# EAGLE design RPi-Display_Bplus_v10 (EAGLE 6.6.0)
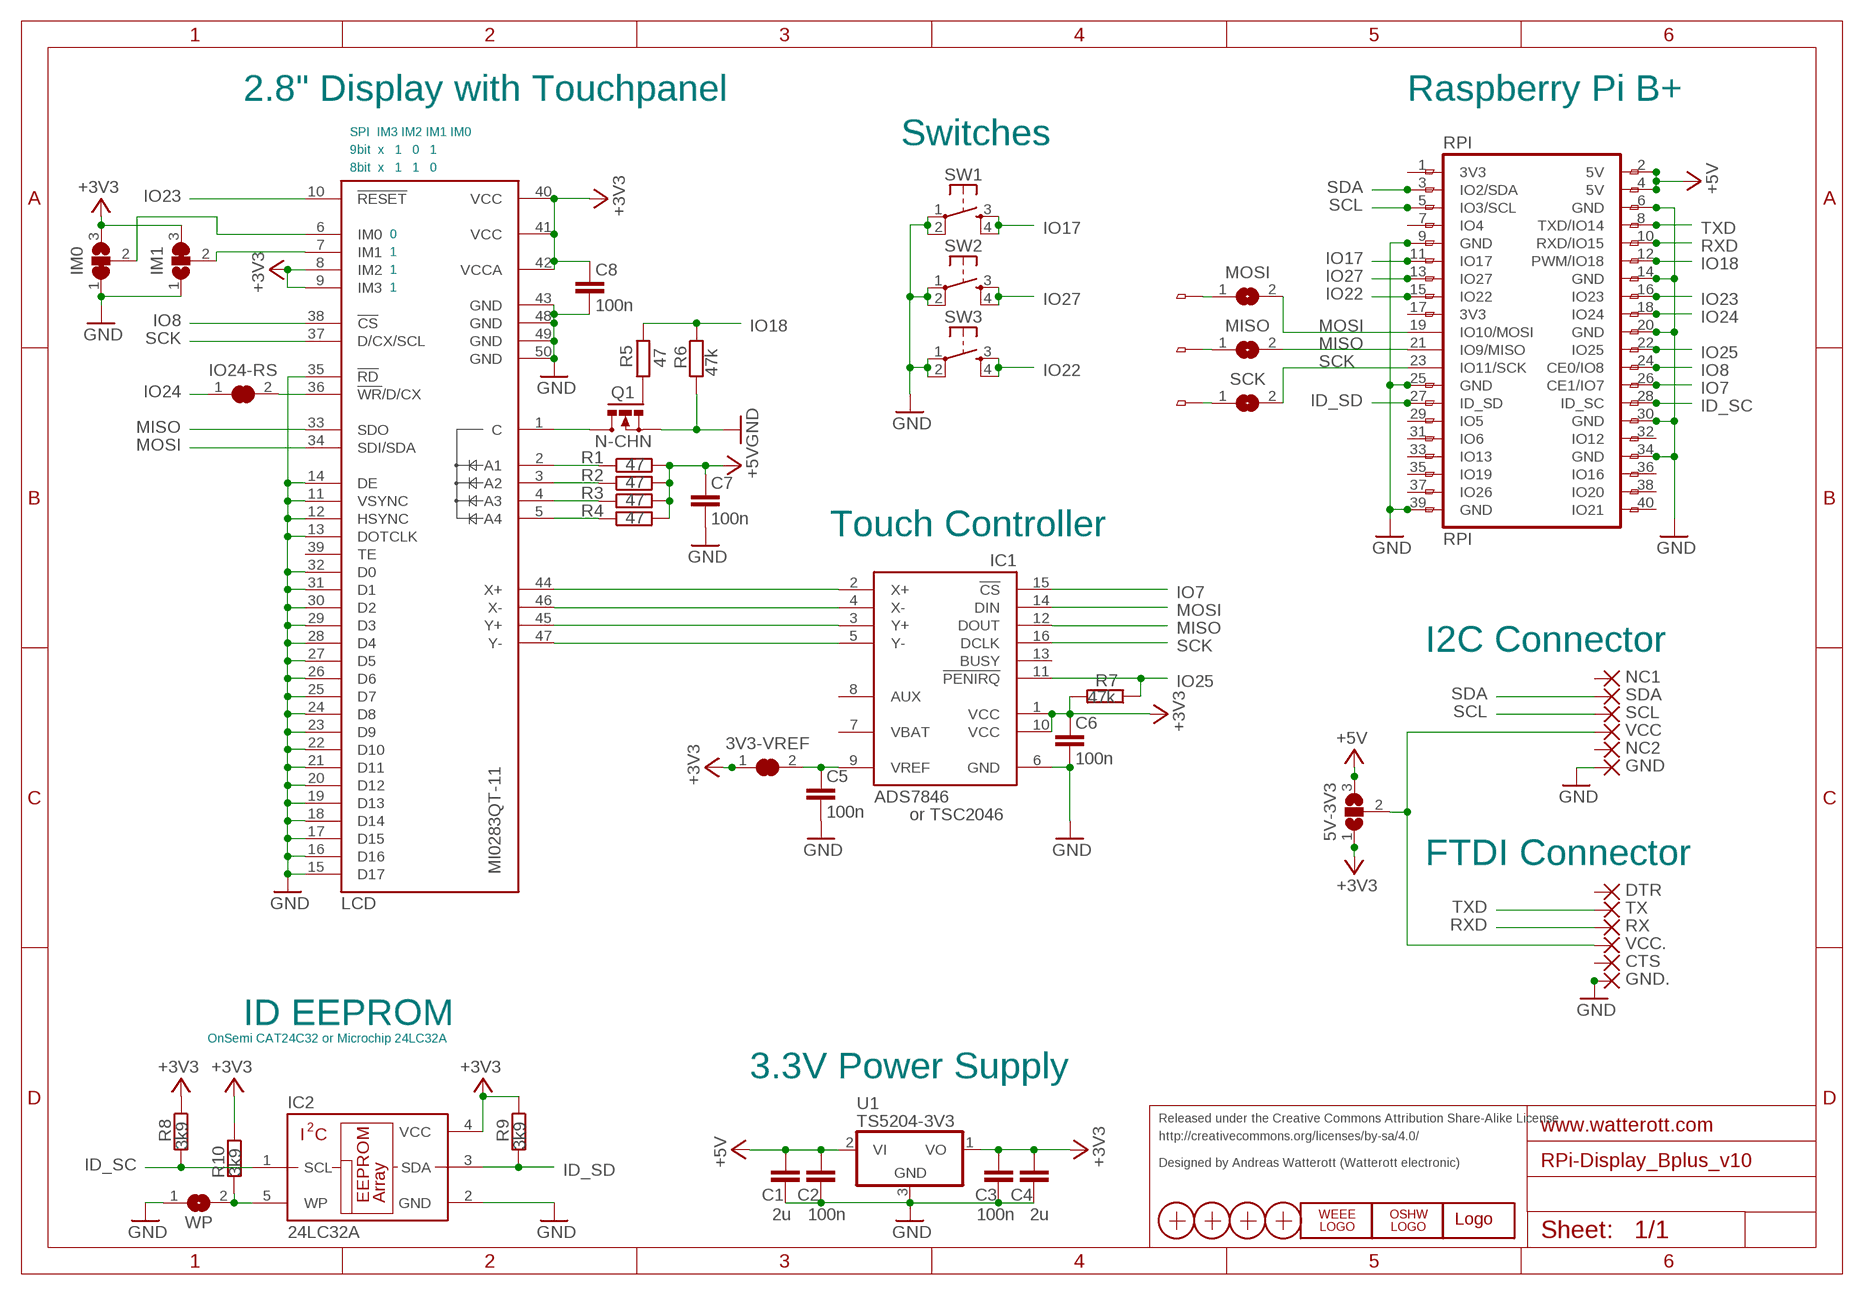
[diagram p0: schematic, sheet 1]

## Parts
3V3-VREF  JUMPER2-NOCREAM  [JUMPER2_NC]
5V-3V3  JUMPER3-NOCREAM  [JUMPER3_NC]
C1  2u  C-EUC0603  [C0603]
C2  100n  C-EUC0603  [C0603]
C3  100n  C-EUC0603  [C0603]
C4  2u  C-EUC0603  [C0603]
C5  100n  C-EUC0603  [C0603]
C6  100n  C-EUC0603  [C0603]
C7  100n  C-EUC0603  [C0603]
C8  100n  C-EUC0603  [C0603]
CTS  PAD-1.27-NC  [PAD-1.27X2.54_NC]
DTR  PAD-1.27-NC  [PAD-1.27X2.54_NC]
GND  PAD-1.27-NC  [PAD-1.27X2.54_NC]
GND.  PAD-1.27-NC  [PAD-1.27X2.54_NC]
GPIO  FH12-40S-0.5SH  [FH12-40S-0.5SH]
IC1  ADS7846  [SSOP16]
IC2  24LC32A  I2C_EEPROM-CAT24AA0X  [SOT23-5]
IM0  JUMPER3-NOCREAM  [JUMPER3_NC]
IM1  JUMPER3-NOCREAM  [JUMPER3_NC]
IO24-RS  JUMPER2-NOCREAM  [JUMPER2_NC]
LCD  MI0283QT-11  [MI0283QT11]
LOGO1  OSHW_LOGO_6MILX0150-NT  [OSHW_6X150_NOTEXT]
LOGO2  WEEE_LOGO  [WEEE]
MISO  JUMPER2-NOCREAM  [JUMPER2_NC]
MOSI  JUMPER2-NOCREAM  [JUMPER2_NC]
NC1  PAD-1.27-NC  [PAD-1.27X2.54_NC]
NC2  PAD-1.27-NC  [PAD-1.27X2.54_NC]
Q1  N-CHN  IRLML2502  [MICRO3]
R1  47  R-EU_R0603  [R0603]
R2  47  R-EU_R0603  [R0603]
R3  47  R-EU_R0603  [R0603]
R4  47  R-EU_R0603  [R0603]
R5  47  R-EU_R0603  [R0603]
R6  47k  R-EU_R0603  [R0603]
R7  47k  R-EU_R0603  [R0603]
R8  3k9  R-EU_R0603  [R0603]
R9  3k9  R-EU_R0603  [R0603]
R10  3k9  R-EU_R0603  [R0603]
RPI  RPI  RPI_B+  [RPI_B+]
RX  PAD-1.27-NC  [PAD-1.27X2.54_NC]
SCK  JUMPER2-NOCREAM  [JUMPER2_NC]
SCL  PAD-1.27-NC  [PAD-1.27X2.54_NC]
SDA  PAD-1.27-NC  [PAD-1.27X2.54_NC]
SW1  SWITCH-PTS840P  [SW_PTS840P]
SW2  SWITCH-PTS840P  [SW_PTS840P]
SW3  SWITCH-PTS840P  [SW_PTS840P]
TX  PAD-1.27-NC  [PAD-1.27X2.54_NC]
U1  TS5204-3V3  TS5204  [SOT23]
U$1  WE-LOGO  WE-LOGOPLACE  [WE-LOGO]
VCC  PAD-1.27-NC  [PAD-1.27X2.54_NC]
VCC.  PAD-1.27-NC  [PAD-1.27X2.54_NC]
WP  JUMPER2-NOCREAM  [JUMPER2_NC]
X1  PASSER  [PASSER]
X2  PASSER  [PASSER]
X3  PASSER  [PASSER]
X4  PASSER  [PASSER]

## Nets
+3V3: 3V3-VREF.1 5V-3V3.1 C3.1 C4.1 C6.1 C8.1 IC1.1(VCC) IC1.10(VCC) IC2.4(VCC) IM0.3 IM1.3 LCD.8(IM2) LCD.9(IM3) LCD.40(VCC) LCD.41(VCC) LCD.42(VCCA) R7.2 R8.1 R9.1 R10.1 U1.1(VO)
+5V: 5V-3V3.3 C1.1 C2.1 C7.1 GPIO.37 GPIO.39 R1.2 R2.2 R3.2 R4.2 RPI.2(5V) RPI.4(5V) U1.2(VI)
C1: LCD.1(C) Q1.3(D)
GND: C1.2 C2.2 C3.2 C4.2 C5.2 C6.2 C7.2 C8.2 GND.1(P) GND..1(P) GPIO.2 GPIO.7 GPIO.11 GPIO.16 GPIO.21 GPIO.27 GPIO.32 GPIO.35 IC1.6(GND) IC2.2(GND) IM0.1 IM1.1 LCD.11(VSYNC) LCD.12(HSYNC) LCD.13(DOTCLK) LCD.14(DE) LCD.15(D17) LCD.16(D16) LCD.17(D15) LCD.18(D14) LCD.19(D13) LCD.20(D12) LCD.21(D11) LCD.22(D10) LCD.23(D9) LCD.24(D8) LCD.25(D7) LCD.26(D6) LCD.27(D5) LCD.28(D4) LCD.29(D3) LCD.30(D2) LCD.31(D1) LCD.32(D0) LCD.35(!RD) LCD.43(GND) LCD.48(GND) LCD.49(GND) LCD.50(GND) Q1.2(S) R6.2 RPI.6(GND) RPI.9(GND) RPI.14(GND) RPI.20(GND) RPI.25(GND) RPI.30(GND) RPI.34(GND) RPI.39(GND) SW1.1(P) SW1.2(P1) SW2.1(P) SW2.2(P1) SW3.1(P) SW3.2(P1) U1.3(GND) WP.1
ID_SC: GPIO.13 IC2.1(SCL) R8.2 RPI.28(ID_SC)
ID_SD: GPIO.14 IC2.3(SDA) R9.2 RPI.27(ID_SD)
IM0: IM0.2 LCD.6(IM0)
IM1: IM1.2 LCD.7(IM1)
IO7: GPIO.15 IC1.15(!CS) RPI.26(CE1/IO7)
IO8: GPIO.17 LCD.38(!CS) RPI.24(CE0/IO8)
IO17: GPIO.30 RPI.11(IO17) SW1.3(S) SW1.4(S1)
IO18: GPIO.29 R5.2 R6.1 RPI.12(PWM/IO18)
IO22: GPIO.26 RPI.15(IO22) SW3.3(S) SW3.4(S1)
IO23: GPIO.25 LCD.10(!RESET) RPI.16(IO23)
IO24: GPIO.23 IO24-RS.1 RPI.18(IO24)
IO25: GPIO.19 IC1.11(!PENIRQ) R7.1 RPI.22(IO25)
IO27: GPIO.28 RPI.13(IO27) SW2.3(S) SW2.4(S1)
LED_A1: LCD.2(A1) R1.1
LED_A2: LCD.3(A2) R2.1
LED_A3: LCD.4(A3) R3.1
LED_A4: LCD.5(A4) R4.1
LEDPWM: Q1.1(G) R5.1
MISO: IC1.12(DOUT) LCD.33(SDO) MISO.2 RPI.21(IO9/MISO)
MOSI: IC1.14(DIN) LCD.34(SDI/SDA) MOSI.2 RPI.19(IO10/MOSI)
N$1: IO24-RS.2 LCD.36(!WR!/D/CX)
N$2: IC2.5(WP) R10.2 WP.2
N$4: GPIO.22 MOSI.1
N$5: 5V-3V3.2 VCC.1(P) VCC..1(P)
N$6: GPIO.20 MISO.1
N$7: GPIO.18 SCK.1
N$8: GPIO.40 RPI.1(3V3)
N$9: GPIO.34 RPI.7(IO4)
N$13: GPIO.24 RPI.17(3V3)
N$15: GPIO.12 RPI.29(IO5)
N$16: GPIO.10 RPI.31(IO6)
N$17: GPIO.8 RPI.33(IO13)
N$18: GPIO.6 RPI.35(IO19)
N$19: GPIO.4 RPI.37(IO26)
N$25: GPIO.9 RPI.32(IO12)
N$27: GPIO.5 RPI.36(IO16)
N$28: GPIO.3 RPI.38(IO20)
N$29: GPIO.1 RPI.40(IO21)
RXD: GPIO.31 RPI.10(RXD/IO15) RX.1(P)
SCK: IC1.16(DCLK) LCD.37(D/CX/SCL) RPI.23(IO11/SCK) SCK.2
SCL: GPIO.36 RPI.5(IO3/SCL) SCL.1(P)
SDA: GPIO.38 RPI.3(IO2/SDA) SDA.1(P)
TXD: GPIO.33 RPI.8(TXD/IO14) TX.1(P)
VREF: 3V3-VREF.2 C5.1 IC1.9(VREF)
X+: IC1.2(X+) LCD.44(X+)
X-: IC1.4(X-) LCD.46(X-)
Y+: IC1.3(Y+) LCD.45(Y+)
Y-: IC1.5(Y-) LCD.47(Y-)
Unconnected: CTS.1(P) DTR.1(P) IC1.7(VBAT) IC1.8(AUX) IC1.13(BUSY) LCD.39(TE) NC1.1(P) NC2.1(P)

## Notes on the sheet
- 2.8" Display with Touchpanel | Raspberry Pi B+
- SPI  IM3 IM2 IM1 IM0
- Switches
- 9bit  x   1   0   1
- 8bit  x   1   1   0
- 0
- 1
- 1
- 1
- Touch Controller
- I2C Connector
- or TSC2046
- FTDI Connector
- ID EEPROM
- OnSemi CAT24C32 or Microchip 24LC32A
- 3.3V Power Supply
- Released under the Creative Commons Attribution Share-Alike License
- http://creativecommons.org/licenses/by-sa/4.0/
- Designed by Andreas Watterott (Watterott electronic)

## Library data of the parts
3V3-VREF IO24-RS MISO MOSI SCK WP = we-rcl:JUMPER2
5V-3V3 IM0 IM1 = we-rcl:JUMPER3
C1-C8 = rcl:C-EU: CAPACITOR, European symbol
CTS DTR GND GND. NC1 NC2 RX SCL SDA TX VCC VCC. = we-rcl:PAD
GPIO = con-hirose:FH12-40S-0.5S: 0.5mm Pitch Connectors For FPC/FFC Source: Data sheet <http://www.hirose.co.jp/cataloge_hp/e58605370.pdf>; MPN: FH12-40S-0.5SH(55); OC_FARNELL: 1324556; OC_NEWARK: 34M6178
IC1 = Display:ADS7846: ADS7846 / TSC2046 Touch Screen Controller
IC2 = we-chip:I2C_EEPROM
LCD = we-opto:MI0283QT: Multi-Inno MIO283QT-9 / -11 Display (240x320) with Ilitek ILI9341 controller
LOGO1 = OSHW:OSHW_LOGO_6MIL
LOGO2 = we-symbol:WEEE_LOGO
Q1 = IRF-sot23:IRLML2502: N-Channel Power MOSFET
R1-R10 = rcl:R-EU_: RESISTOR, European symbol
RPI = we-board:RPI_B+: Raspberry Pi Model B+
SW1-SW3 = we-switch:SWITCH
U1 = Voltage-Reg:TS5204
U$1 = welectronic:WE-LOGO
X1-X4 = SMD:PASSER

## Board
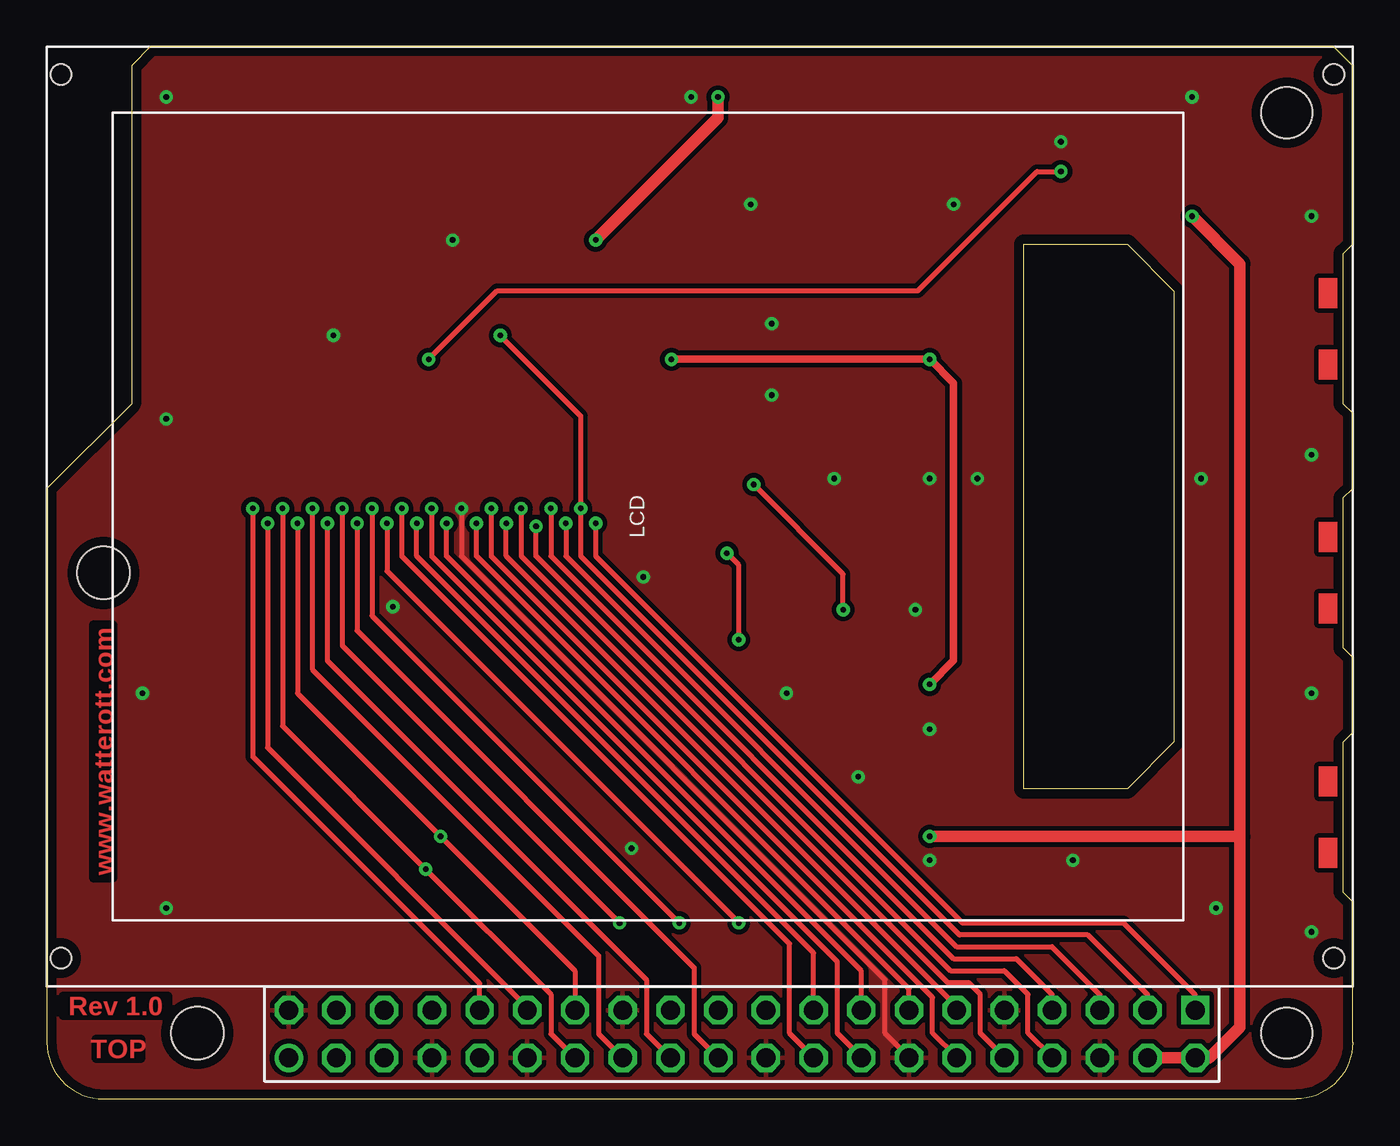
[diagram p1: board, top side]
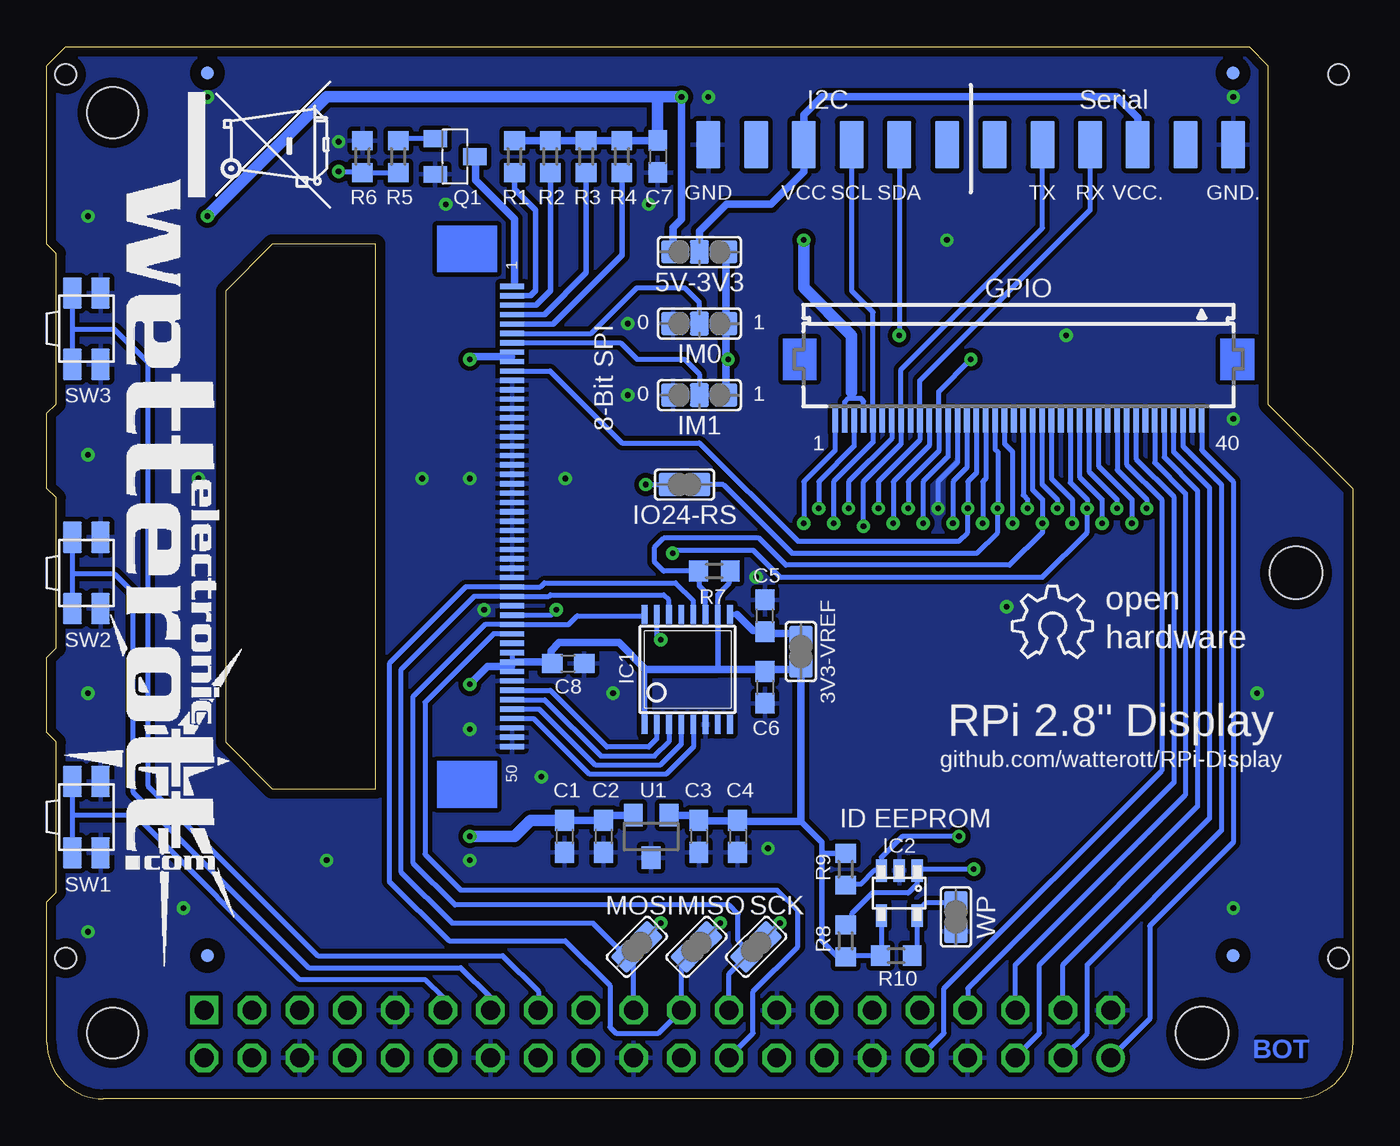
[diagram p2: board, bottom side, seen from below]

Size 69.5 x 56 mm. Coordinates in mm from the lower left corner, seen from the top.
Outline: 3,0 66.5,0 arc90 69.5,3 69.5,10.5 69,11 69,19 69.5,19.5 69.5,23.5 69,24 69,32 69.5,32.5 69.5,36.5 69,37 69,45 69.5,45.5 69.5,55 68.5,56 5.5,56 4.5,55 4.5,37 0,32.5 0,3 arc90 3,0
Copper layers (1*16): Top 0.035mm / dielectric 1.5mm / Bottom 0.035mm
Design rules "default *": minimum track width 6mil, minimum drill 0.3mm, track to track 6mil, track to pad 6mil, pad to pad 6mil, via to via 6mil, smd to smd 6mil, copper to edge 20mil, drill to drill 8mil, minimum pad ring 10mil, minimum via ring 8mil, stop-mask expansion 0.3mm, vias tented up to drill 0.5mm, thermal gap 10mil
Holes 2.8 mm at 3,28 8,3.5
Holes 2.7 mm at 66,3.5 66,52.5

### Footprints (pad centres in the part's own frame; a part is rotated, then mirrored left to right if it is on the bottom)
JUMPER2_NC = smd 1.25 x 1.25: 1 0,0.76; 2 0,-0.76
JUMPER3_NC = smd 1.25 x 1.25: 1 0,1.4; 3 0,-1.4 | smd 1.25 x 1: 2 0,0
C0603 = smd 1.1 x 1: 1 -0.85,0; 2 0.85,0
PAD-1.27X2.54_NC = smd 1.27 x 2.54: 1 0,0
FH12-40S-0.5SH = smd 0.3 x 1.3: 1 -9.75,3.25; 2 -9.25,3.25; 3 -8.75,3.25; 4 -8.25,3.25; 5 -7.75,3.25; 6 -7.25,3.25; 7 -6.75,3.25; 8 -6.25,3.25; 9 -5.75,3.25; 10 -5.25,3.25; 11 -4.75,3.25; 12 -4.25,3.25; 13 -3.75,3.25; 14 -3.25,3.25; 15 -2.75,3.25; 16 -2.25,3.25; 17 -1.75,3.25; 18 -1.25,3.25; 19 -0.75,3.25; 20 -0.25,3.25; 21 0.25,3.25; 22 0.75,3.25; 23 1.25,3.25; 24 1.75,3.25; 25 2.25,3.25; 26 2.75,3.25; 27 3.25,3.25; 28 3.75,3.25; 29 4.25,3.25; 30 4.75,3.25; 31 5.25,3.25; 32 5.75,3.25; 33 6.25,3.25; 34 6.75,3.25; 35 7.25,3.25; 36 7.75,3.25; 37 8.25,3.25; 38 8.75,3.25; 39 9.25,3.25; 40 9.75,3.25
SSOP16 = smd 0.305 x 1.016: 1 -2.925,-2.918; 2 -2.275,-2.918; 3 -1.625,-2.918; 4 -0.975,-2.918; 5 -0.325,-2.918; 6 0.325,-2.918; 7 0.975,-2.918; 8 1.625,-2.918; 9 1.625,2.918; 10 0.975,2.918; 11 0.325,2.918; 12 -0.325,2.918; 13 -0.975,2.918; 14 -1.625,2.918; 15 -2.275,2.918; 16 -2.925,2.918
SOT23-5 = smd 1.2 x 0.6: 1 -1.2,0.95; 2 -1.2,0; 3 -1.2,-0.95; 4 1.2,-0.95; 5 1.2,0.95
MI0283QT11 = smd 0.279 x 1.27 bottom: 1 12.25,24.762; 2 11.75,24.762; 3 11.25,24.762; 4 10.75,24.762; 5 10.25,24.762; 6 9.75,24.762; 7 9.25,24.762; 8 8.75,24.762; 9 8.25,24.762; 10 7.75,24.762; 11 7.25,24.762; 12 6.75,24.762; 13 6.25,24.762; 14 5.75,24.762; 15 5.25,24.762; 16 4.75,24.762; 17 4.25,24.762; 18 3.75,24.762; 19 3.25,24.762; 20 2.75,24.762; 21 2.25,24.762; 22 1.75,24.762; 23 1.25,24.762; 24 0.75,24.762; 25 0.25,24.762; 26 -0.25,24.762; 27 -0.75,24.762; 28 -1.25,24.762; 29 -1.75,24.762; 30 -2.25,24.762; 31 -2.75,24.762; 32 -3.25,24.762; 33 -3.75,24.762; 34 -4.25,24.762; 35 -4.75,24.762; 36 -5.25,24.762; 37 -5.75,24.762; 38 -6.25,24.762; 39 -6.75,24.762; 40 -7.25,24.762; 41 -7.75,24.762; 42 -8.25,24.762; 43 -8.75,24.762; 44 -9.25,24.762; 45 -9.75,24.762; 46 -10.25,24.762; 47 -10.75,24.762; 48 -11.25,24.762; 49 -11.75,24.762; 50 -12.25,24.762 | hole 1.1: 23.54,1; -23.5,1; 23.54,68.75; -23.5,68.75
MICRO3 = smd 0.9 x 1.25: 1 -0.95,-1.05; 2 0.95,-1.05; 3 0,1.05
R0603 = smd 1 x 1.1: 1 -0.85,0; 2 0.85,0
RPI_B+ = drill 1 square: 1 -24.13,-1.27 | drill 1 octagon: 2 -24.13,1.27; 3 -21.59,-1.27; 4 -21.59,1.27; 5 -19.05,-1.27; 6 -19.05,1.27; 7 -16.51,-1.27; 8 -16.51,1.27; 9 -13.97,-1.27; 10 -13.97,1.27; 11 -11.43,-1.27; 12 -11.43,1.27; 13 -8.89,-1.27; 14 -8.89,1.27; 15 -6.35,-1.27; 16 -6.35,1.27; 17 -3.81,-1.27; 18 -3.81,1.27; 19 -1.27,-1.27; 20 -1.27,1.27; 21 1.27,-1.27; 22 1.27,1.27; 23 3.81,-1.27; 24 3.81,1.27; 25 6.35,-1.27; 26 6.35,1.27; 27 8.89,-1.27; 28 8.89,1.27; 29 11.43,-1.27; 30 11.43,1.27; 31 13.97,-1.27; 32 13.97,1.27; 33 16.51,-1.27; 34 16.51,1.27; 35 19.05,-1.27; 36 19.05,1.27; 37 21.59,-1.27; 38 21.59,1.27; 39 24.13,-1.27 | drill 1: 40 24.13,1.27
SW_PTS840P = smd 1.65 x 1: 1 -1.9,0.75; 2 1.9,0.75; 3 -1.9,-0.75; 4 1.9,-0.75
SOT23 = smd 1 x 1.2: 1 -0.95,-1.132; 2 0.95,-1.132; 3 0,1.132
PASSER = smd 0.7 x 0.7: X 0,0

### Placement (x,y rotation side)
3V3-VREF  29.37,23.81 180 bottom
5V-3V3  34.77,45.09 270 bottom
C1  41.94,13.97 270 bottom
C2  39.88,13.97 270 bottom
C3  34.8,13.97 270 bottom
C4  32.73,13.97 270 bottom
C5  31.27,25.72 90 bottom
C6  31.27,21.91 270 bottom
C7  36.99,50.16 270 bottom
C8  41.75,23.18 0 bottom
CTS  8.89,50.8 0 bottom
DTR  19.05,50.8 0 bottom
GND  34.29,50.8 0 bottom
GND.  6.35,50.8 0 bottom
GPIO  17.78,39.37 180 bottom
IC1  34.77,22.86 0 bottom
IC2  24.13,10.95 270 bottom
IM0  34.77,41.27 90 bottom
IM1  34.77,37.47 90 bottom
IO24-RS  35.56,32.7 270 bottom
LCD  69.5,31 90 top
LOGO1  18.1,23.5 0 bottom
LOGO2  57.15,50.8 270 bottom
MISO  34.92,8.1 315 bottom
MOSI  38.1,8.1 315 bottom
NC1  21.59,50.8 0 bottom
NC2  31.75,50.8 0 bottom
Q1  47.78,50.16 270 bottom
R1  44.61,50.16 90 bottom
R2  42.7,50.16 90 bottom
R3  40.8,50.16 90 bottom
R4  38.89,50.16 90 bottom
R5  50.8,50.16 270 bottom
R6  52.7,50.16 90 bottom
R7  33.97,28.1 0 bottom
R8  26.99,8.41 90 bottom
R9  26.99,12.22 270 bottom
R10  24.29,7.62 0 bottom
RPI  37,3.45 180 top
RX  13.97,50.8 0 bottom
SCK  31.75,8.1 315 bottom
SCL  26.67,50.8 0 bottom
SDA  24.13,50.8 0 bottom
SW1  67.4,15 270 bottom
SW2  67.4,28 270 bottom
SW3  67.4,41 270 bottom
TX  16.51,50.8 0 bottom
U1  37.34,13.97 180 bottom
U$1  68.9,49.21 270 bottom
VCC  29.21,50.8 0 bottom
VCC.  11.43,50.8 0 bottom
WP  21.11,9.68 180 bottom
X1  6.35,7.62 0 bottom
X2  6.35,54.61 0 bottom
X3  60.96,54.61 0 bottom
X4  60.96,7.62 0 bottom

### Tracks (layer width: path | path; a pad name or v marks a point on that pad's centre or on a via)
+3V3  (via drill 0.3)
  Top 0.406: v33.24,39.37 v46.99,39.37 48.26,38.1 48.26,23.34 v46.99,22.07
  Bottom 0.254: LCD.40 LCD.41 LCD.42 44.74,22.99 44.77,23.02 | 35.08,15.1 34.98,15.1 34.67,14.8 | C4.1 32.76,14.8 32.73,14.8 32.7,14.76 | 31.33,22.73 31.3,22.73 C6.1 | 33.79,22.88 33.81,22.86 | C8.1 42.67,23.25 42.67,23.36 42.66,23.37 | IC1.10 33.79,26.85 33.18,27.46 33.18,28.04 R7.2 | 28.16,13.07 28.26,13.18 | LCD.8 44.74,39.56 44.77,39.53 | 31.17,22.86 C6.1 | 31.38,22.86 C6.1 | 37.69,22.79 37.62,22.86 | 27.04,7.62 R8.1 26.93,7.62 R10.1 25.08,7.68 IC2.4 | 29.5,23.05 3V3-VREF.1
  Bottom 0.305: LCD.8 LCD.9 | IC1.10 33.79,22.88 | 29.37,14.76 28.26,13.65 28.26,13.18 28.26,8.41 27.46,7.62 27.04,7.62 | R9.1 28.16,13.07 | IC1.1 37.69,22.79
  Bottom 0.406: C3.1 35.08,15.1 U1.1 | 34.67,14.8 32.76,14.8 | 31.38,22.86 33.81,22.86 37.62,22.86 39.05,24.29 42.23,24.29 42.66,23.85 42.66,23.37 | LCD.41 42.67,23.25 | 32.7,14.76 29.37,14.76 3V3-VREF.1 | 44.77,39.53 46.83,39.53 v46.99,39.37 | 44.77,23.02 46.04,23.02 v46.99,22.07 | 29.5,23.05 29.69,22.86 31.17,22.86 | IM1.3 33.37,39.25 v33.24,39.37 33.37,39.49 IM0.3 5V-3V3.1
+5V  (via drill 0.3)
  Top 0.61: v46.99,13.97 63.5,13.97 | v29.21,45.72 35.72,52.23 v35.72,53.34 | RPI.4 RPI.2 61.87,2.18 63.5,3.81 63.5,13.97 | 63.5,13.97 63.5,44.45 v60.96,46.99
  Bottom 0.254: GPIO.37 26.03,37.14 26.19,37.31 26.67,37.31 | GPIO.39 27.03,37.1 26.83,37.31 26.67,37.31 | 36.99,53.18 36.83,53.34 | 26.67,37.62 26.67,37.31
  Bottom 0.406: C1.1 C2.1 39.6,15.1 U1.2 | C7.1 R4.2 R3.2 R2.2 R1.2 | v35.72,53.34 35.72,46.83 36.17,46.38 5V-3V3.3
  Bottom 0.61: v35.72,53.34 36.83,53.34 54.61,53.34 59.69,48.26 v60.96,46.99 | C1.1 43.76,14.82 44.61,13.97 v46.99,13.97 | v29.21,45.72 29.21,43.18 26.67,40.64 26.67,37.62 | C7.1 36.99,53.18
C1
  Bottom 0.254: LCD.1 44.61,43.25 44.61,43.5
  Bottom 0.406: 44.61,43.5 44.61,46.83 46.67,48.9 46.67,50.1 Q1.3
GND  (via drill 0.3)
  Top 0.254: v22.07,31.43 22.07,28.89 44.61,6.35 44.61,3.49 45.89,2.21 RPI.14
  Bottom 0.254: GPIO.27 21.03,33.9 22.07,32.86 v22.07,31.43
  other vias: 6.35,53.34 46.99,33.02 46.23,26.04 39.37,21.59 34.29,53.34 38.58,41.27 38.58,37.47 37.47,47.62 48.26,47.62 41.91,33.02 53.98,50.96 46.99,19.68 31.11,13.34 31.75,27.78 6.35,36.2 6.35,10.16 62.23,10.16 60.96,53.34 18.41,26.19 5.08,21.59 67.31,46.99 67.31,21.59 49.53,33.02 46.99,12.7 15.24,40.64 43.18,17.14 21.59,45.72 61.44,33.02 54.61,12.7 67.31,34.29 67.31,8.89
  pour Top (isolate 0.254): 0,0 69.5,0 69.5,56 0,56
  pour Bottom (isolate 0.254): 0,0 69.5,0 69.5,56 0,56
ID_SC  (via drill 0.3)
  Top 0.254: v12.54,31.43 12.54,19.84 v20.16,12.22 26.83,5.56 26.83,3.46 RPI.28
  Bottom 0.254: GPIO.13 14.03,33.4 12.54,31.91 v12.54,31.43 | v20.16,12.22 23.11,12.22 IC2.1 23.18,11.43 23.65,10.95 25.56,10.95 26.67,9.84 26.67,9.58 R8.2
ID_SD  (via drill 0.3)
  Top 0.254: v13.34,30.64 13.34,21.59 v20.95,13.97 28.11,6.82 RPI.27
  Bottom 0.254: GPIO.14 14.53,33.1 13.34,31.91 v13.34,30.64 | 27.04,11.43 R9.2 26.93,11.43 26.19,11.43 25.47,12.15 IC2.3 25.08,12.86 23.97,13.97 v20.95,13.97
IM0
  Bottom 0.254: LCD.6 40.53,40.75 38.1,43.18 35.56,43.18 34.77,42.39 IM0.2
IM1
  Bottom 0.254: LCD.7 38.98,40.25 38.1,39.37 35.56,39.37 34.77,38.58 IM1.2
IO7  (via drill 0.3)
  Top 0.254: v14.13,31.43 14.13,22.86 29.37,7.62 29.37,3.46 RPI.26 | v36.83,24.45 36.83,28.42 v36.2,29.05
  Bottom 0.254: GPIO.15 15.03,32.81 14.13,31.91 v14.13,31.43 14.13,30.16 16.51,27.78 30.48,27.78 31.91,29.21 36.04,29.21 v36.2,29.05 | IC1.15 37.04,24.66 v36.83,24.45
IO8  (via drill 0.3)
  Top 0.254: v14.92,30.64 14.92,23.34 31.91,6.35 31.91,3.46 RPI.24
  Bottom 0.254: GPIO.17 16.03,33.02 14.92,31.91 v14.92,30.64 | RPI.24 33.19,2.21 31.91,3.49 31.91,5.71 29.53,8.1 29.53,10 30.64,11.11 47.47,11.11 49.37,13.02 49.37,21.11 45.73,24.75 LCD.38
IO17  (via drill 0.3)
  Top 0.254: v24.45,30.64 24.45,28.89 48.42,4.92 48.42,4.73 RPI.11
  Bottom 0.254: GPIO.30 22.53,34.78 24.45,32.86 v24.45,30.64 | SW1.3 68.15,15.08 | 68.15,15.08 SW1.4 | RPI.11 48.42,4.73 48.42,5.4 49.37,6.35 56.04,6.35 64.77,15.08 68.15,15.08
IO18  (via drill 0.3)
  Top 0.254: v23.65,31.43 23.65,28.89 47.15,5.4 47.15,3.49 48.43,2.21 RPI.12 | v20.32,39.37 23.97,43.02 46.35,43.02 52.7,49.37 v53.98,49.37
  Bottom 0.254: R5.2 R6.1 52.76,49.37 v53.98,49.37 | v23.65,31.43 23.65,32.86 22.03,34.48 GPIO.29 22.03,37.66 v20.32,39.37
IO22  (via drill 0.3)
  Top 0.254: RPI.15 43.35,6.82 21.27,28.89 v21.27,30.64
  Bottom 0.254: GPIO.26 20.53,33.6 21.27,32.86 v21.27,30.64 | SW3.3 68.15,40.96 | 68.15,40.96 SW3.4 | RPI.15 43.34,4.73 43.34,5.71 45.24,7.62 55.09,7.62 64.14,16.67 64.14,39.21 65.88,40.96 68.15,40.96
IO23  (via drill 0.3)
  Top 0.254: v20.48,31.43 20.48,28.89 42.07,7.3 42.07,3.49 43.35,2.21 RPI.16
  Bottom 0.254: GPIO.25 20.03,33.31 20.48,32.86 v20.48,31.43 20.48,30.16 20.95,29.69 29.53,29.69 34.77,34.92 38.89,34.92 42.72,38.75 LCD.10
IO24  (via drill 0.3)
  Top 0.254: v18.89,31.43 18.89,28.89 39.53,8.26 39.53,3.49 40.81,2.21 RPI.18
  Bottom 0.254: GPIO.23 19.03,34.59 18.89,34.45 v18.89,31.43 18.89,30.16 20,29.05 29.84,29.05 33.5,32.7 IO24-RS.1
IO25  (via drill 0.3)
  Top 0.254: v16.51,30.64 16.51,24.92 34.45,6.99 34.45,3.46 RPI.22
  Bottom 0.254: GPIO.19 17.03,32.43 16.51,31.91 v16.51,30.64 16.51,30.16 18.26,28.42 30.16,28.42 31.59,29.84 36.67,29.84 37.15,29.37 37.15,28.57 36.67,28.1 R7.1 34.77,28.04 34.77,27.3 34.44,26.98 IC1.11
IO27  (via drill 0.3)
  Top 0.254: RPI.13 45.89,5.86 22.86,28.89 v22.86,30.64
  Bottom 0.254: GPIO.28 21.53,34.19 22.86,32.86 v22.86,30.64 | SW2.3 68.15,27.94 | 68.15,27.94 SW2.4 | RPI.13 45.89,5.4 47.48,6.99 55.56,6.99 64.93,16.35 64.93,26.99 65.88,27.94 68.15,27.94
LED_A1
  Bottom 0.305: LCD.2 43.77,42.75 43.5,43.02 43.5,47.31 44.61,48.42 R1.1
LED_A2
  Bottom 0.305: LCD.3 43.48,42.25 42.7,43.02 R2.1
LED_A3
  Bottom 0.305: LCD.4 43.02,41.75 40.8,43.97 R3.1
LED_A4
  Bottom 0.305: LCD.5 42.57,41.25 38.89,44.93 R4.1
LEDPWM
  Bottom 0.254: Q1.1 50.7,51.12 R5.1
MISO
  Bottom 0.254: IC1.12 35.09,26.52 36.04,27.46 43.02,27.46 43.23,27.25 LCD.33 47.2,27.25 51.28,23.18 51.28,11.59 48.1,8.41 41.91,8.41 39.53,6.03 39.53,3.81 39.21,3.49 36.96,3.49 RPI.21 35.73,7.29 MISO.2
MOSI
  Bottom 0.254: IC1.14 36.39,26.55 36.67,26.83 42.7,26.83 42.78,26.75 LCD.34 46.75,26.75 50.64,22.86 50.64,12.06 47.94,9.37 40.45,9.37 MOSI.2 38.27,7.19 RPI.19
N$1  (via drill 0.3)
  Top 0.254: v42.39,26.04 42.39,27.94 v37.62,32.7
  Bottom 0.254: LCD.36 42.67,25.75 v42.39,26.04 | v37.62,32.7 IO24-RS.2
N$2
  Bottom 0.254: R10.2 23.18,7.88 IC2.5 23.18,10 22.73,10.44 WP.2
N$4  (via drill 0.3)
  Top 0.254: v18.1,30.64 18.1,28.1 v36.83,9.37
  Bottom 0.254: GPIO.22 18.53,34.88 18.1,34.45 v18.1,30.64 | v36.83,9.37 MOSI.1
N$5
  Bottom 0.406: VCC..1 11.43,52.23 12.54,53.34 28.26,53.34 29.21,52.39 VCC.1 29.21,49.37 30.96,47.62 33.34,47.62 34.77,46.2 5V-3V3.2
N$6  (via drill 0.3)
  Top 0.254: v17.3,31.43 17.3,25.72 v33.66,9.37
  Bottom 0.254: GPIO.20 17.53,32.13 17.3,31.91 v17.3,31.43 | v33.66,9.37 MISO.1
N$7  (via drill 0.3)
  Top 0.254: v15.72,31.43 15.72,24.13 v30.48,9.37
  Bottom 0.254: GPIO.18 16.53,32.72 15.72,31.91 v15.72,31.43 | v30.48,9.37 SCK.1
N$8  (via drill 0.3)
  Top 0.254: v29.21,30.64 29.21,28.89 48.74,9.37 57.31,9.37 61.13,5.54 RPI.1
  Bottom 0.254: v29.21,30.64 29.21,32.86 27.53,34.54 GPIO.40
N$9  (via drill 0.3)
  Top 0.254: v26.83,31.43 26.83,28.89 48.26,7.46 51.59,7.46 53.51,5.54 RPI.7
  Bottom 0.254: GPIO.34 24.53,35.16 26.83,32.86 v26.83,31.43
N$10
  Bottom 0.203: 29.37,24.29 29.37,23.18
N$13  (via drill 0.3)
  Top 0.254: RPI.17 40.81,7.77 19.68,28.89 v19.68,30.64
  Bottom 0.254: GPIO.24 19.53,33.02 19.68,32.86 v19.68,30.64
N$14
  Bottom 0.203: 35.08,32.7 36.04,32.7
N$15  (via drill 0.3)
  Top 0.254: v11.75,30.64 11.75,18.7 25.57,4.88 RPI.29
  Bottom 0.254: GPIO.12 13.53,33.69 11.75,31.91 v11.75,30.64
N$16  (via drill 0.3)
  Top 0.254: v10.95,31.43 10.95,18.23 23.03,6.15 RPI.31
  Bottom 0.254: GPIO.10 12.53,33.48 10.95,31.91 v10.95,31.43
N$17
  Bottom 0.254: GPIO.8 11.53,34.07 9.53,32.07 9.53,16.8 9.56,16.8 20.48,5.87 20.48,4.73 RPI.33
N$18
  Bottom 0.254: RPI.35 17.95,7.13 8.89,16.19 8.89,32.23 10.53,33.87 GPIO.6
N$19
  Bottom 0.254: RPI.37 15.41,7.13 7.62,14.92 7.62,32.54 9.53,34.45 GPIO.4
N$20
  Bottom 0.203: 33.34,37.47 34.61,37.47
N$22
  Bottom 0.203: 34.92,41.27 36.04,41.27
N$25
  Bottom 0.254: RPI.32 23.03,2.21 21.75,3.49 21.75,5.87 10.16,17.46 10.16,31.91 12.03,33.78 GPIO.9
N$27
  Bottom 0.254: RPI.36 17.95,2.21 16.67,3.49 16.67,7.14 8.26,15.56 8.26,32.38 10.03,34.16 GPIO.5
N$28
  Bottom 0.254: RPI.38 15.41,2.21 14.13,3.49 14.13,7.14 6.99,14.29 6.99,32.7 9.03,34.75 GPIO.3
N$29
  Bottom 0.254: RPI.40 10.79,4.25 10.79,9.21 6.35,13.65 6.35,32.86 8.03,34.54 GPIO.1
RXD  (via drill 0.3)
  Top 0.254: v25.24,31.43 25.24,28.89 47.94,6.19 49.05,6.19 49.69,5.56 49.69,3.49 50.97,2.21 RPI.10
  Bottom 0.254: RX.1 13.97,47.31 23.03,38.25 GPIO.31 23.03,35.07 25.24,32.86 v25.24,31.43
SCK
  Bottom 0.254: LCD.37 44.76,25.27 | LCD.37 41.74,25.25 41.27,25.72 37.75,25.72 IC1.16 | RPI.23 33.19,6.66 SCK.2 32.29,8 32.7,8.41 32.7,9.84 33.18,10.32 47.78,10.32 50.01,12.54 50.01,21.43 46.19,25.25 LCD.37
SCL  (via drill 0.3)
  Top 0.254: v27.62,30.64 27.62,28.89 48.42,8.1 53.5,8.1 56.05,5.54 RPI.5
  Bottom 0.254: SCL.1 26.67,43.02 25.53,41.88 GPIO.36 25.53,34.95 27.62,32.86 v27.62,30.64
SDA  (via drill 0.3)
  Top 0.254: RPI.3 58.59,5.54 55.4,8.73 48.58,8.73 28.42,28.89 v28.42,31.43 28.42,36.35 v24.13,40.64
  Bottom 0.254: GPIO.38 26.53,34.75 28.42,32.86 v28.42,31.43 | SDA.1 v24.13,40.64
TXD  (via drill 0.3)
  Top 0.254: RPI.8 53.51,2.21 52.23,3.49 52.23,5.56 50.96,6.83 48.1,6.83 26.04,28.89 v26.04,30.48
  Bottom 0.254: TX.1 16.51,46.35 24.03,38.84 GPIO.33 24.03,34.87 26.04,32.86 v26.04,30.48
VREF
  Bottom 0.254: 31.33,24.92 C5.1 | 29.69,24.77 29.5,24.57 3V3-VREF.2
  Bottom 0.305: IC1.9 32.76,25.78
  Bottom 0.406: 32.76,25.78 31.91,24.92 31.33,24.92 | 29.69,24.77 31.17,24.77 C5.1
X+
  Bottom 0.254: LCD.44 42.7,21.75 39.69,18.73 37.47,18.73 37.04,19.16 IC1.2
X-
  Bottom 0.254: LCD.46 43.29,20.75 40.32,17.78 36.83,17.78 35.74,18.87 IC1.4
Y+
  Bottom 0.254: LCD.45 43,21.25 40.01,18.26 37.15,18.26 36.39,19.01 IC1.3
Y-
  Bottom 0.254: LCD.47 43.59,20.25 40.64,17.3 36.51,17.3 35.09,18.73 IC1.5

### Text on the board
Top: www.watterott.com | Rev 1.0 | TOP
Bottom: BOT
bPlace: Serial | I2C | 8-Bit SPI | 40 | 1 | open | hardware | RPi 2.8" Display | github.com/watterott/RPi-Display | ID EEPROM
bNames: 1 | 0 | 1 | 0
Reference: 2.4mm PCB, Silkscreen: 22 bPlace + 26 bNames